# EAGLE schematic proje (EAGLE 6.3)
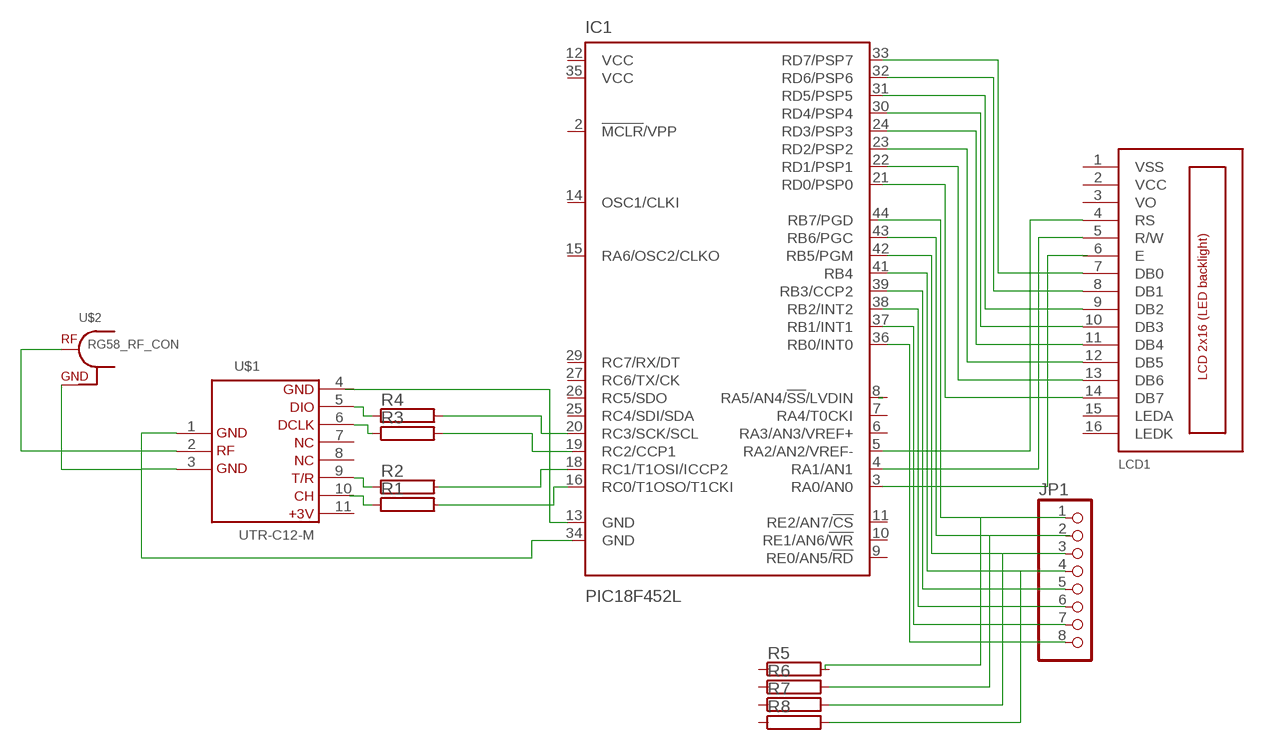
[diagram p0: schematic, sheet 1]

## Parts
IC1  PIC18F452L  [PLCC-44]
JP1  PINHD-1X8  [1X08]
LCD1  LCD_2X16_SIL  [HY-1602F]
R1  RAC01  [AC01]
R2  RAC01  [AC01]
R3  RAC01  [AC01]
R4  RAC01  [AC01]
R5  RAC01  [AC01]
R6  RAC01  [AC01]
R7  RAC01  [AC01]
R8  RAC01  [AC01]
U$1  UTR-C12-M  [UTR-C12-M]
U$2  RG58_RF_CON  [RG58_RF_CON]

## Nets
N$1: R1.1
N$2: R2.1 U$1.9
N$3: R3.1 U$1.6
N$4: R4.1 U$1.5
N$5: IC1.16(RC0/T1OSO/T1CKI)
N$6: IC1.18(RC1/T1OSI/ICCP2)
N$7: R3.2
N$8: IC1.20(RC3/SCK/SCL) R4.2
N$9: IC1.13(GND)
N$10: U$1.1 U$1.3 U$2.GND
N$11: LCD1.7(DB0)
N$12: IC1.32(RD6/PSP6) LCD1.8(DB1)
N$13: LCD1.9(DB2)
N$14: IC1.30(RD4/PSP4) LCD1.10(DB3)
N$15: IC1.24(RD3/PSP3) LCD1.11(DB4)
N$16: IC1.23(RD2/PSP2) LCD1.12(DB5)
N$17: IC1.22(RD1/PSP1) LCD1.13(DB6)
N$18: LCD1.14(DB7)
N$20: U$1.2 U$2.RF
N$22: LCD1.5(R/W)
N$23: LCD1.4(RS)
N$24: JP1.1
N$25: IC1.43(RB6/PGC) R6.2
N$26: IC1.42(RB5/PGM) JP1.3 R7.2
N$27: IC1.41(RB4) JP1.4 R8.2
N$28: IC1.39(RB3/CCP2) JP1.5
N$29: JP1.6
N$30: JP1.7
N$31: IC1.36(RB0/INT0) JP1.8
Unconnected: IC1.1(NC) IC1.2(!MCLR!/VPP) IC1.3(RA0/AN0) IC1.4(RA1/AN1) IC1.5(RA2/AN2/VREF-) IC1.6(RA3/AN3/VREF+) IC1.7(RA4/T0CKI) IC1.8(RA5/AN4/!SS!/LVDIN) IC1.9(RE0/AN5/!RD) IC1.10(RE1/AN6/!WR) IC1.11(RE2/AN7/!CS) IC1.14(OSC1/CLKI) IC1.15(RA6/OSC2/CLKO) IC1.17(NC) IC1.19(RC2/CCP1) IC1.21(RD0/PSP0) IC1.25(RC4/SDI/SDA) IC1.26(RC5/SDO) IC1.27(RC6/TX/CK) IC1.28(NC) IC1.29(RC7/RX/DT) IC1.31(RD5/PSP5) IC1.33(RD7/PSP7) IC1.37(RB1/INT1) IC1.38(RB2/INT2) IC1.40(NC) IC1.44(RB7/PGD) JP1.2 LCD1.3(VO) LCD1.6(E) LCD1.15(LEDA) LCD1.16(LEDK) R1.2 R2.2 R5.1 R5.2 R6.1 R7.1 R8.1 U$1.4 U$1.7 U$1.8 U$1.10 U$1.11

## Power pins joined to a net without a drawn wire
GND: IC1.34(GND)
VCC: IC1.12(VCC) IC1.35(VCC) LCD1.2(VCC)
VSS: LCD1.1(VSS)

## Library data of the parts
IC1 = microchip:PIC18F*2: High-Performance, Enhanced Flash Microcontrollers with 10-Bit A/D Source: http://www.microchip.com .. 39564c.pdf; MF: MICROCHIP; MPN: PIC18F452I/L; OC_FARNELL: 9762221; OC_NEWARK: 34C8340
JP1 = pinhead:PINHD-1X8: PIN HEADER
LCD1 = lcd_2x16_led_backlight:LCD_2X16_SIL
R1-R8 = resistor-power:R: Power Resitor; OC_FARNELL: unknown; OC_NEWARK: unknown
U$1 = UDEA_HAKKI:UTR-C12-M
U$2 = UDEA_HAKKI:RG58_RF_CON